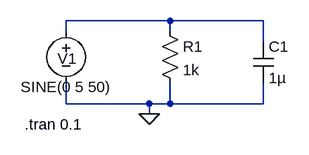
[diagram p0: schematic RC Parallel Circuit.asc]
RC Parallel Circuit.asc, the LTspice schematic file:
Version 4
SHEET 1 880 680
WIRE 224 112 64 112
WIRE 368 112 224 112
WIRE 64 128 64 112
WIRE 224 128 224 112
WIRE 368 144 368 112
WIRE 64 240 64 208
WIRE 192 240 64 240
WIRE 224 240 224 208
WIRE 224 240 192 240
WIRE 368 240 368 208
WIRE 368 240 224 240
WIRE 192 256 192 240
FLAG 192 256 0
SYMBOL res 208 112 R0
SYMATTR InstName R1
SYMATTR Value 1k
SYMBOL cap 352 144 R0
SYMATTR InstName C1
SYMATTR Value 1µ
SYMBOL voltage 64 112 R0
WINDOW 0 -13 58 Left 2
WINDOW 3 -70 102 Left 2
WINDOW 123 0 0 Left 0
WINDOW 39 0 0 Left 0
SYMATTR InstName V1
SYMATTR Value SINE(0 5 50)
TEXT 0 272 Left 2 !.tran 0.1

The netlist it stands for:
* RC Parallel Circuit.asc
R1 N001 0 1k
C1 N001 0 1µ
V1 N001 0 SINE(0 5 50)
.tran 0.1
.backanno
.end